# Altium schematic sheet Sheet1.SchDoc
size A4
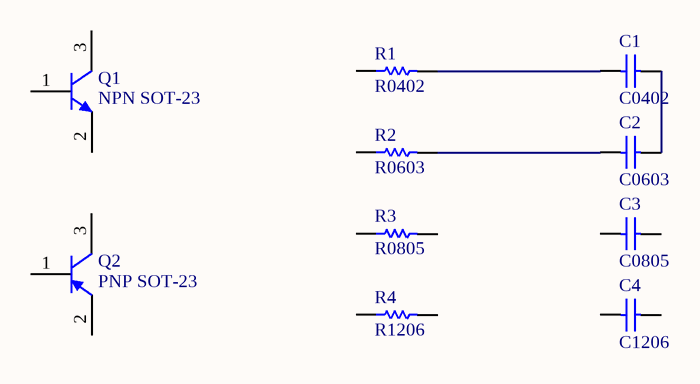
[diagram p0: Sheet1.SchDoc]

## Parts
C1  C0402  [CAPC1005X06N]
C2  C0603  [CAPC1608X09N]
C3  C0805  [CAPC2012X12N]
C4  C1206  [CAPC3216X19N]
Q1  NPN SOT-23  [SOT95P245X110-3N]
Q2  PNP SOT-23  [SOT95P245X110-3N]
R1  R0402  [RESC1005X04N]
R2  R0603  [RESC1608X06N]
R3  R0805  [RESC2012X06N]
R4  R1206  [RESC3016X06N]

## Nets
NetC1_1: C1.1 R1.2
NetC1_2: C1.2 C2.2
NetC2_1: C2.1 R2.2

Not connected (* = marked no-connect by the designer): C3 1 2; C4 1 2; Q1 1(B) 2(E) 3(C); Q2 1(B) 2(E) 3(C); R1 1; R2 1; R3 1 2; R4 1 2

## Library data of the parts
C1 = GEN0000007: Generic capacitor C0402; ID: GEN0000007; Footprint_Name: C0402; Value: C0402
C2 = GEN0000008: Generic capacitor C0603; ID: GEN0000008; Footprint_Name: C0603; Value: C0603
C3 = GEN0000009: Generic capacitor C0805; ID: GEN0000009; Footprint_Name: C0805; Value: C0805
C4 = GEN0000010: Generic capacitor C1206; ID: GEN0000010; Footprint_Name: C1206; Value: C1206
Q1 = GEN0000001: Generic NPN BJT transistor SOT-23; ID: GEN0000001; Footprint_Name: SOT-23; Value: NPN SOT-23
Q2 = GEN0000002: Generic PNP BJT transistor SOT-23; ID: GEN0000002; Footprint_Name: SOT-23; Value: PNP SOT-23
R1 = GEN0000003: Generic resistor R0402; ID: GEN0000003; Footprint_Name: R0402; Value: R0402
R2 = GEN0000004: Generic resistor R0603; ID: GEN0000004; Footprint_Name: R0603; Value: R0603
R3 = GEN0000005: Generic resistor R0805; ID: GEN0000005; Footprint_Name: R0805; Value: R0805
R4 = GEN0000006: Generic resistor R1206; ID: GEN0000006; Footprint_Name: R1206; Value: R1206